# Altium project LimeSDR_1v2s.PrjPcb (part 3 of 4)

## Sheet 14_BoardPowerSupply.SchDoc: Board power supply
size A3; Organization: Lime Microsystems; Address1: Surrey Tech Centre; Address2: Guildford GU2 7YG; Address3: Surrey; Address4: United Kingdom; Revision: v1.2; SheetNumber: 14; SheetTotal: 14
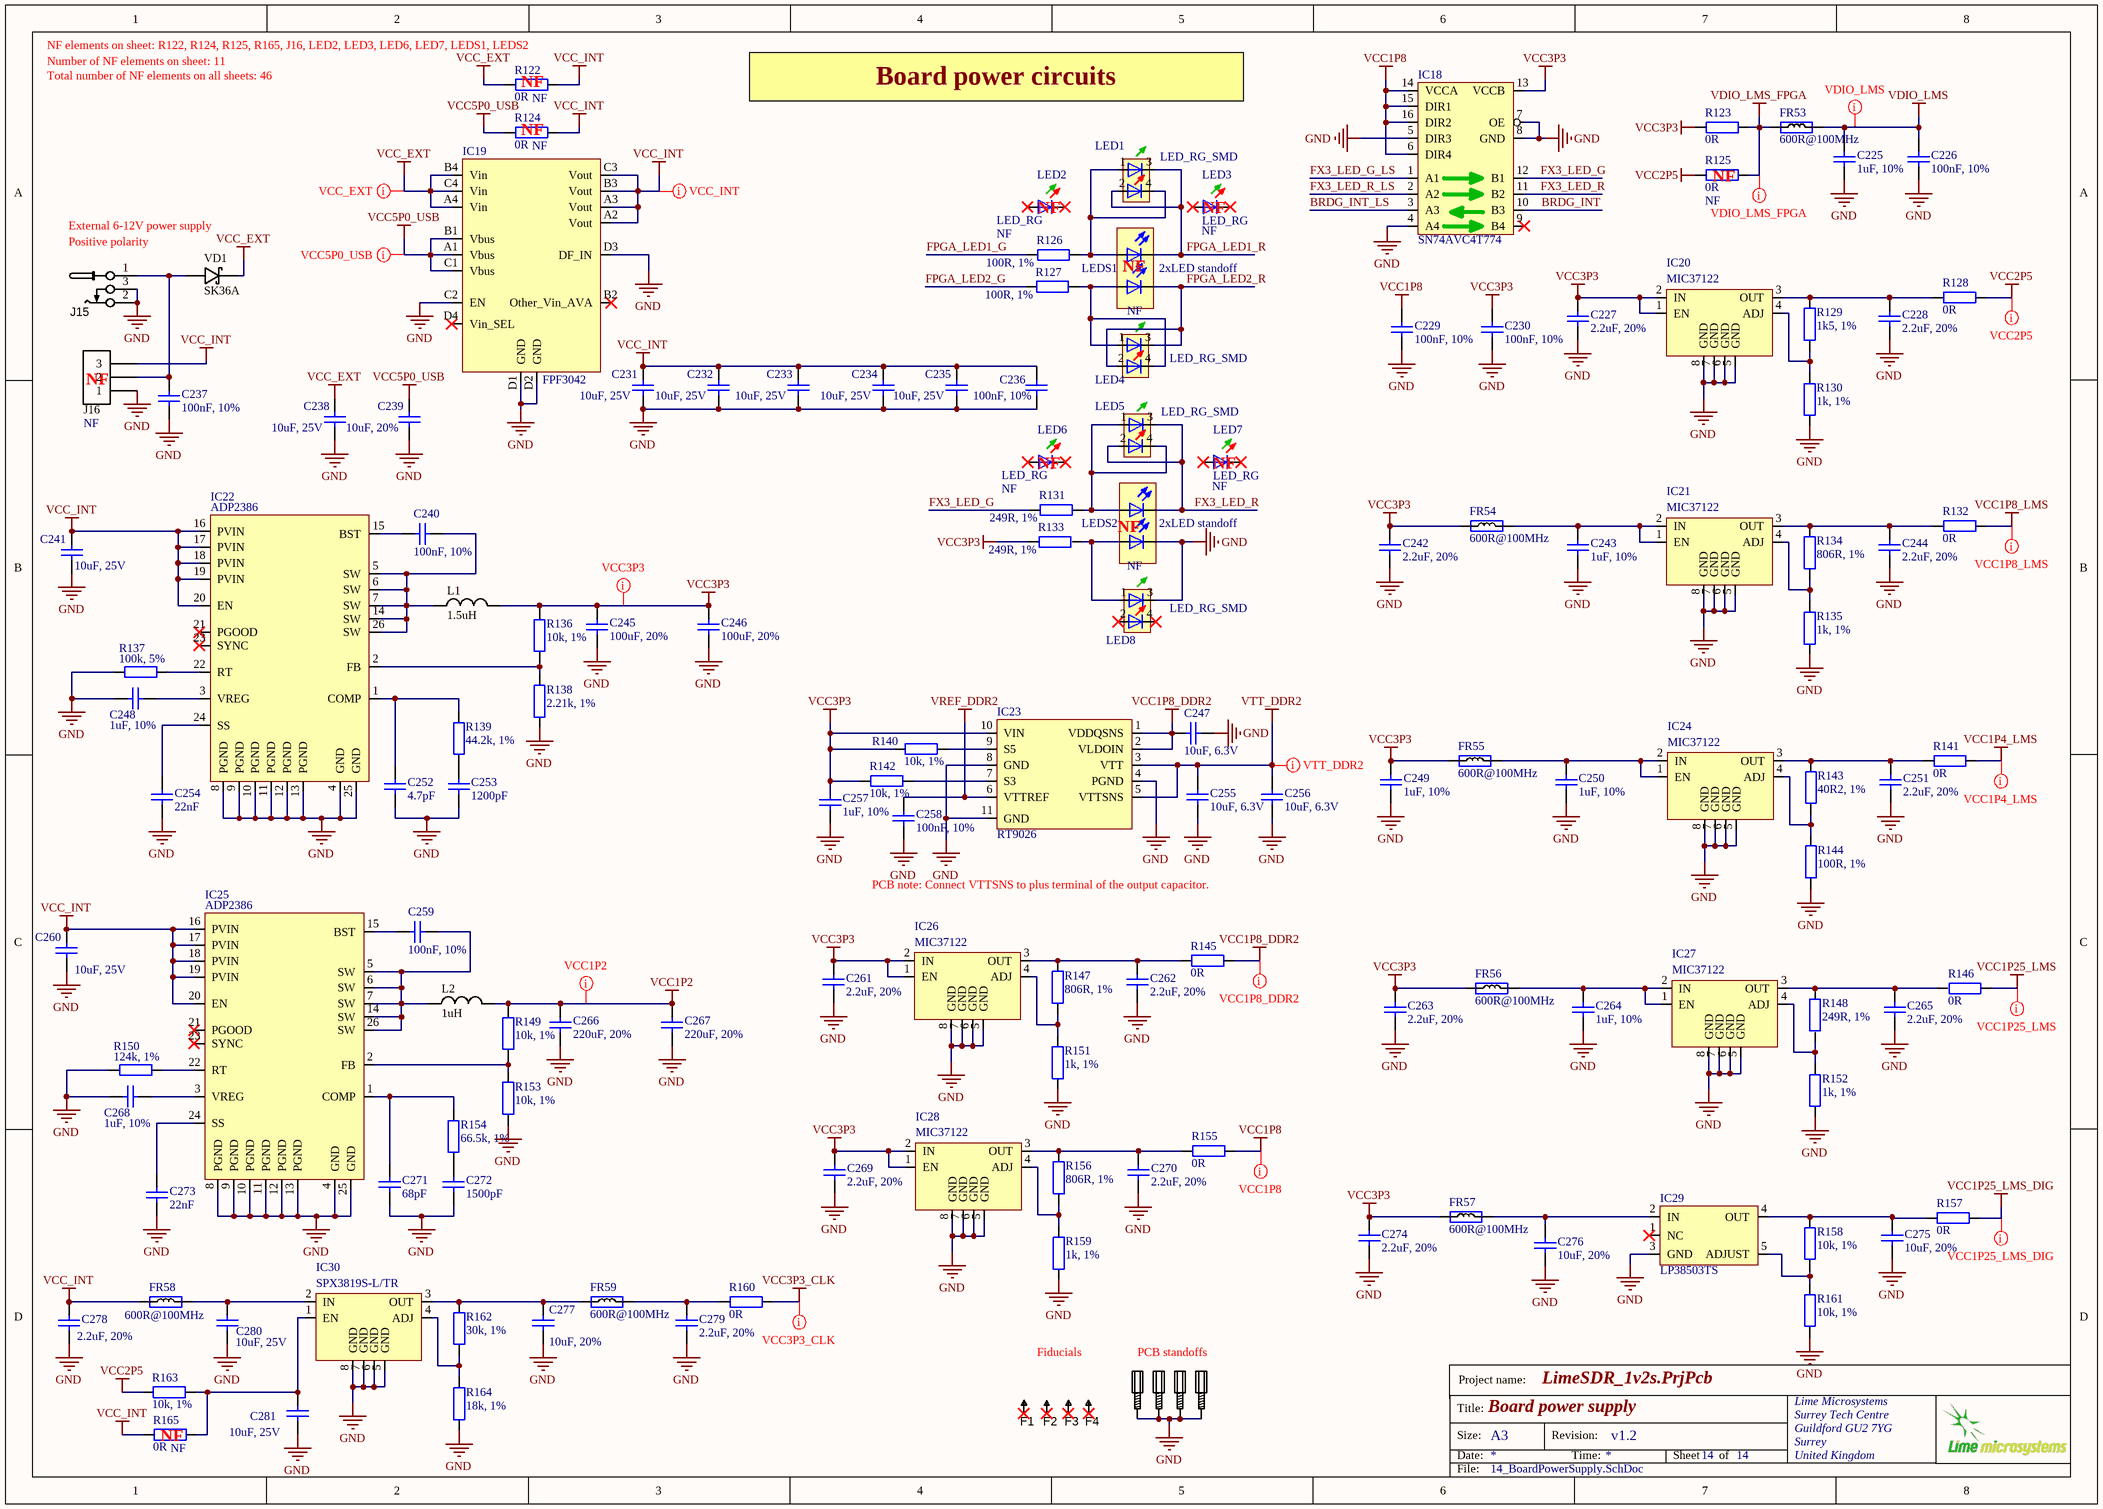
[diagram p9: 14_BoardPowerSupply.SchDoc]

### Parts
C225  1uF, 10%  [CAP0402]
C226  100nF, 10%  [CAP0402]
C227  2.2uF, 20%  [CAP0402]
C228  2.2uF, 20%  [CAP0402]
C229  100nF, 10%  [CAP0402]
C230  100nF, 10%  [CAP0402]
C231  10uF, 25V  [CAP0603]
C232  10uF, 25V  [CAP0603]
C233  10uF, 25V  [CAP0603]
C234  10uF, 25V  [CAP0603]
C235  10uF, 25V  [CAP0603]
C236  100nF, 10%  [CAP0402]
C237  100nF, 10%  [CAP0402]
C238  10uF, 25V  [CAP0603]
C239  10uF, 20%  [CAP0603]
C240  100nF, 10%  [CAP0402]
C241  10uF, 25V  [CAP0603]
C242  2.2uF, 20%  [CAP0402]
C243  1uF, 10%  [CAP0402]
C244  2.2uF, 20%  [CAP0402]
C245  100uF, 20%  [CAP1206]
C246  100uF, 20%  [CAP1206]
C247  10uF, 6.3V  [CAP0603]
C248  1uF, 10%  [CAP0402]
C249  1uF, 10%  [CAP0402]
C250  1uF, 10%  [CAP0402]
C251  2.2uF, 20%  [CAP0402]
C252  4.7pF  [CAP0402]
C253  1200pF  [CAP0402]
C254  22nF  [CAP0402]
C255  10uF, 6.3V  [CAP0603]
C256  10uF, 6.3V  [CAP0603]
C257  1uF, 10%  [CAP0402]
C258  100nF, 10%  [CAP0402]
C259  100nF, 10%  [CAP0402]
C260  10uF, 25V  [CAP0603]
C261  2.2uF, 20%  [CAP0402]
C262  2.2uF, 20%  [CAP0402]
C263  2.2uF, 20%  [CAP0402]
C264  1uF, 10%  [CAP0402]
C265  2.2uF, 20%  [CAP0402]
C266  220uF, 20%  [CAP1206]
C267  220uF, 20%  [CAP1206]
C268  1uF, 10%  [CAP0402]
C269  2.2uF, 20%  [CAP0402]
C270  2.2uF, 20%  [CAP0402]
C271  68pF  [CAP0402]
C272  1500pF  [CAP0402]
C273  22nF  [CAP0402]
C274  2.2uF, 20%  [CAP0402]
C275  10uF, 20%  [CAP0603]
C276  10uF, 20%  [CAP0603]
C277  10uF, 20%  [CAP0603]
C278  2.2uF, 20%  [CAP0402]
C279  2.2uF, 20%  [CAP0402]
C280  10uF, 25V  [CAP0603]
C281  10uF, 25V  [CAP0603]
F1  Fiducial  [Fiducial]  (value not drawn)
F2  Fiducial  [Fiducial]  (value not drawn)
F3  Fiducial  [Fiducial]  (value not drawn)
F4  Fiducial  [Fiducial]  (value not drawn)
FR53  600R@100MHz  [RES0805]
FR54  600R@100MHz  [RES0805]
FR55  600R@100MHz  [RES0805]
FR56  600R@100MHz  [RES0805]
FR57  600R@100MHz  [RES0805]
FR58  600R@100MHz  [RES0805]
FR59  600R@100MHz  [RES0805]
IC18  SN74AVC4T774  [SN74AVC4T774]
IC19  FPF3042  [FPF3042]
IC20  MIC37122  [MIC37122YM TR_SO8]
IC21  MIC37122  [MIC37122YM TR_SO8]
IC22  ADP2386  [ADP2386]
IC23  RT9026  [MSOP10]
IC24  MIC37122  [MIC37122YM TR_SO8]
IC25  ADP2386  [ADP2386]
IC26  MIC37122  [MIC37122YM TR_SO8]
IC27  MIC37122  [MIC37122YM TR_SO8]
IC28  MIC37122  [MIC37122YM TR_SO8]
IC29  LP38503TS  [TO-263-5_v2]
IC30  SPX3819S-L/TR  [MIC37122YM TR_SO8]
J15  CONN_PWR_JACK_2.1x5.5mm  [CONN_PWR_JACK_v3]  (value not drawn)
J16  Assembly Info: NF  [HDR_1x3]  (hidden comment: Header 3x1 pin)
L1  1.5uH  [FDVE1040_TOKO_INDUCTOR]
L2  1uH  [FDVE1040_TOKO_INDUCTOR]
LED1  LED_RG_SMD  [LED-2x0603]
LED2  LED_RG  Assembly Info: NF  (mechanical)
LED3  LED_RG  Assembly Info: NF  (mechanical)
LED4  LED_RG_SMD  [LED-2x0603]
LED5  LED_RG_SMD  [LED-2x0603]
LED6  LED_RG  Assembly Info: NF  (mechanical)
LED7  LED_RG  Assembly Info: NF  (mechanical)
LED8  LED_RG_SMD  [LED-2x0603]
LEDS1  2xLED standoff  Assembly Info: NF  [LED_STANDOFF_H-201C]
LEDS2  2xLED standoff  Assembly Info: NF  [LED_STANDOFF_H-201C]
MECH1  # pcs.  [PCB_standoff]  (value not drawn)
MECH2  # pcs.  [PCB_standoff]  (value not drawn)
MECH3  # pcs.  [PCB_standoff]  (value not drawn)
MECH4  # pcs.  [PCB_standoff]  (value not drawn)
R122  0R  Assembly Info: NF  [RES0402]
R123  0R  [RES0402]
R124  0R  Assembly Info: NF  [RES0402]
R125  0R  Assembly Info: NF  [RES0402]
R126  100R, 1%  [RES0402]
R127  100R, 1%  [RES0402]
R128  0R  [RES0402]
R129  1k5, 1%  [RES0402]
R130  1k, 1%  [RES0402]
R131  249R, 1%  [RES0402]
R132  0R  [RES0402]
R133  249R, 1%  [RES0402]
R134  806R, 1%  [RES0402]
R135  1k, 1%  [RES0402]
R136  10k, 1%  [RES0402]
R137  100k, 5%  [RES0402]
R138  2.21k, 1%  [RES0402]
R139  44.2k, 1%  [RES0402]
R140  10k, 1%  [RES0402]
R141  0R  [RES0402]
R142  10k, 1%  [RES0402]
R143  40R2, 1%  [RES0402]
R144  100R, 1%  [RES0402]
R145  0R  [RES0402]
R146  0R  [RES0402]
R147  806R, 1%  [RES0402]
R148  249R, 1%  [RES0402]
R149  10k, 1%  [RES0402]
R150  124k, 1%  [RES0402]
R151  1k, 1%  [RES0402]
R152  1k, 1%  [RES0402]
R153  10k, 1%  [RES0402]
R154  66.5k, 1%  [RES0402]
R155  0R  [RES0402]
R156  806R, 1%  [RES0402]
R157  0R  [RES0402]
R158  10k, 1%  [RES0402]
R159  1k, 1%  [RES0402]
R160  0R  [RES0402]
R161  10k, 1%  [RES0402]
R162  30k, 1%  [RES0402]
R163  10k, 1%  [RES0402]
R164  18k, 1%  [RES0402]
R165  0R  Assembly Info: NF  [RES0402]
VD1  SK36A  [DIODE_SMB]

### Nets
GND: C225.1 C226.2 C227.1 C228.1 C229.1 C230.1 C231.1 C232.1 C233.1 C234.1 C235.1 C236.2 C237.2 C238.1 C239.1 C241.1 C242.1 C243.1 C244.1 C245.1 C246.1 C247.1 C248.2 C249.1 C250.1 C251.1 C252.2 C253.2 C254.2 C255.1 C256.1 C257.1 C258.2 C260.1 C261.1 C262.1 C263.1 C264.1 C265.1 C266.1 C267.1 C268.2 C269.1 C270.1 C271.2 C272.2 C273.2 C274.1 C275.1 C276.1 C277.1 C278.1 C279.1 C280.1 C281.1 IC18.4(A4) IC18.5(DIR3) IC18.7(OE) IC18.8(GND) IC19.C2(EN) IC19.D1(GND) IC19.D2(GND) IC19.D3(DF_IN) IC20.5(GND) IC20.6(GND) IC20.7(GND) IC20.8(GND) IC21.5(GND) IC21.6(GND) IC21.7(GND) IC21.8(GND) IC22.4(GND) IC22.8(PGND) IC22.9(PGND) IC22.10(PGND) IC22.11(PGND) IC22.12(PGND) IC22.13(PGND) IC22.25(GND) IC23.4(PGND) IC23.8(GND) IC23.11(GND) IC24.5(GND) IC24.6(GND) IC24.7(GND) IC24.8(GND) IC25.4(GND) IC25.8(PGND) IC25.9(PGND) IC25.10(PGND) IC25.11(PGND) IC25.12(PGND) IC25.13(PGND) IC25.25(GND) IC26.5(GND) IC26.6(GND) IC26.7(GND) IC26.8(GND) IC27.5(GND) IC27.6(GND) IC27.7(GND) IC27.8(GND) IC28.5(GND) IC28.6(GND) IC28.7(GND) IC28.8(GND) IC29.3(GND) IC30.5(GND) IC30.6(GND) IC30.7(GND) IC30.8(GND) J15.2 J15.3 J16.1 LED8.3 LEDS2.K2(C) MECH1.MH1 MECH2.MH1 MECH3.MH1 MECH4.MH1 R130.1 R135.1 R137.2 R138.1 R144.2 R150.2 R151.1 R152.1 R153.2 R159.1 R161.2 R164.1
VCC1P2: C266.2 C267.2 L2.2 R149.1
VCC1P4_LMS: R141.1
VCC1P8: C229.2 IC18.6(DIR4) IC18.14(VCCA) IC18.15(DIR1) IC18.16(DIR2) R155.1
VCC1P8_DDR2: C247.2 IC23.1(VDDQSNS) IC23.2(VLDOIN) R145.1
VCC1P8_LMS: R132.1
VCC1P25_LMS: R146.1
VCC1P25_LMS_DIG: R157.1
VCC2P5: R125.2 R128.1 R163.1
VCC3P3: C227.2 C230.2 C242.2 C245.2 C246.2 C249.2 C257.2 C261.2 C263.2 C269.2 C274.2 FR54.1 FR55.1 FR56.1 FR57.1 IC18.13(VCCB) IC20.1(EN) IC20.2(IN) IC23.10(VIN) IC26.1(EN) IC26.2(IN) IC28.1(EN) IC28.2(IN) L1.2 R123.2 R133.1 R136.1 R140.1 R142.1
VCC3P3_CLK: R160.1
VCC5P0_USB: C239.2 IC19.A1(Vbus) IC19.B1(Vbus) IC19.C1(Vbus) R124.2
VCC_EXT: C238.2 IC19.A4(Vin) IC19.B4(Vin) IC19.C4(Vin) R122.2 VD1.K
VCC_INT: C231.2 C232.2 C233.2 C234.2 C235.2 C236.1 C241.2 C260.2 C278.2 FR58.1 IC19.A2(Vout) IC19.A3(Vout) IC19.B3(Vout) IC19.C3(Vout) IC22.16(PVIN) IC22.17(PVIN) IC22.18(PVIN) IC22.19(PVIN) IC22.20(EN) IC25.16(PVIN) IC25.17(PVIN) IC25.18(PVIN) IC25.19(PVIN) IC25.20(EN) J16.3 R122.1 R124.1 R165.2
VDIO_LMS: C225.2 C226.1 FR53.2
VDIO_LMS_FPGA: FR53.1 R123.1 R125.1
VREF_DDR2: C258.1 IC23.6(VTTREF)
VTT_DDR2: C255.2 C256.2 IC23.3(VTT) IC23.5(VTTSNS)
BRDG_INT: IC18.10(B3)
BRDG_INT_LS: IC18.3(A3)
FPGA_LED1_G: R126.1
FPGA_LED1_R: LED1.2 LED1.3 LEDS1.K1(C)
FPGA_LED2_G: R127.1
FPGA_LED2_R: LED4.2 LED4.3 LEDS1.K2(C)
FX3_LED_G: IC18.12(B1) R131.1
FX3_LED_G_LS: IC18.1(A1)
FX3_LED_R: IC18.11(B2) LED5.2 LED5.3 LEDS2.K1(C)
FX3_LED_R_LS: IC18.2(A2)
NetC228_2: C228.2 IC20.3(OUT) R128.2 R129.1
NetC237_1: C237.1 J15.1 J16.2 VD1.A
NetC240_1: C240.1 IC22.15(BST)
NetC240_2: C240.2 IC22.5(SW) IC22.6(SW) IC22.7(SW) IC22.14(SW) IC22.26(SW) L1.1
NetC243_2: C243.2 FR54.2 IC21.1(EN) IC21.2(IN)
NetC244_2: C244.2 IC21.3(OUT) R132.2 R134.1
NetC248_1: C248.1 IC22.3(VREG)
NetC250_2: C250.2 FR55.2 IC24.1(EN) IC24.2(IN)
NetC251_2: C251.2 IC24.3(OUT) R141.2 R143.1
NetC252_1: C252.1 IC22.1(COMP) R139.2
NetC253_1: C253.1 R139.1
NetC254_1: C254.1 IC22.24(SS)
NetC259_1: C259.1 IC25.15(BST)
NetC259_2: C259.2 IC25.5(SW) IC25.6(SW) IC25.7(SW) IC25.14(SW) IC25.26(SW) L2.1
NetC262_2: C262.2 IC26.3(OUT) R145.2 R147.1
NetC264_2: C264.2 FR56.2 IC27.1(EN) IC27.2(IN)
NetC265_2: C265.2 IC27.3(OUT) R146.2 R148.1
NetC268_1: C268.1 IC25.3(VREG)
NetC270_2: C270.2 IC28.3(OUT) R155.2 R156.1
NetC271_1: C271.1 IC25.1(COMP) R154.2
NetC272_1: C272.1 R154.1
NetC273_1: C273.1 IC25.24(SS)
NetC275_2: C275.2 IC29.4(OUT) R157.2 R158.1
NetC276_2: C276.2 FR57.2 IC29.2(IN)
NetC277_2: C277.2 FR59.1 IC30.3(OUT) R162.1
NetC279_2: C279.2 FR59.2 R160.2
NetC280_2: C280.2 FR58.2 IC30.2(IN)
NetC281_2: C281.2 IC30.1(EN) R163.2 R165.1
NetIC20_4: IC20.4(ADJ) R129.2 R130.2
NetIC21_4: IC21.4(ADJ) R134.2 R135.2
NetIC22_2: IC22.2(FB) R136.2 R138.2
NetIC22_22: IC22.22(RT) R137.1
NetIC23_7: IC23.7(S3) R142.2
NetIC23_9: IC23.9(S5) R140.2
NetIC24_4: IC24.4(ADJ) R143.2 R144.1
NetIC25_2: IC25.2(FB) R149.2 R153.1
NetIC25_22: IC25.22(RT) R150.1
NetIC26_4: IC26.4(ADJ) R147.2 R151.2
NetIC27_4: IC27.4(ADJ) R148.2 R152.2
NetIC28_4: IC28.4(ADJ) R156.2 R159.2
NetIC29_5: IC29.5(ADJUST) R158.2 R161.1
NetIC30_4: IC30.4(ADJ) R162.2 R164.2
NetLED1_1: LED1.1 LED1.4 LEDS1.A1(A) R126.2
NetLED4_1: LED4.1 LED4.4 LEDS1.A2(A) R127.2
NetLED5_1: LED5.1 LED5.4 LEDS2.A1(A) R131.2
NetLED8_1: LED8.1 LEDS2.A2(A) R133.2

Not connected (* = marked no-connect by the designer): F1 1*; F2 1*; F3 1*; F4 1*; IC18 9(B4)*; IC19 B2(Other_Vin_AVA)* D4(Vin_SEL)*; IC22 21(PGOOD)* 23(SYNC)*; IC25 21(PGOOD)* 23(SYNC)*; IC29 1(NC)*; LED2 A* K(C)*; LED3 A* K(C)*; LED6 A* K(C)*; LED7 A* K(C)*; LED8 2* 4*

### Layout directives
net class VDIO_LMS: VDIO_LMS
net class VDIO_LMS_FPGA: VDIO_LMS_FPGA
net class VCC2P5: VCC2P5
net class VCC1P8_LMS: VCC1P8_LMS
net class VCC1P4_LMS: VCC1P4_LMS
net class VCC1P25_LMS: VCC1P25_LMS
net class VCC1P25_LMS_DIG: VCC1P25_LMS_DIG
net class VCC1P8_DDR2: VCC1P8_DDR2
net class VCC1P8: VCC1P8
net class VCC3P3_CLK: VCC3P3_CLK
net class VCC1P2: VCC1P2
net class VCC3P3: VCC3P3
net class VCC_INT: VCC_INT
net class VCC_EXT: VCC_EXT
net class VCC5P0_USB: VCC5P0_USB
net class VTT_DDR2: VTT_DDR2

### Notes on the sheet
- Number of NF elements on sheet: 11
- Total number of NF elements on all sheets: 46
- (near R122) NF elements on sheet: R122, R124, R125, R165, J16, LED2, LED3, LED6, LED7, LEDS1, LEDS2
- (near R122) NF
- Board power circuits
- (near R124) NF
- (near R125) NF
- Positive polarity
- External 6-12V power supply
- (near LED2) NF
- (near LED3) NF
- (near LEDS1) NF
- (near J16) NF
- (near LED6) NF
- (near LED7) NF
- (near LEDS2) NF
- PCB note: Connect VTTSNS to plus terminal of the output capacitor.
- Fiducials
- PCB standoffs
- (near R165) NF
- Project name:
- Title:
- Size:
- Date:
- A3
- Revision:
- Time:
- Sheet
- of
- File:

### Library data of the parts
C225 C243 C248-C250 C257 C264 C268 = Cap_0402: Manufacturer Part Number 1: GRM155R61A105KE15J; Manufacturer: TDK; Part Description: 1µF ±10% 10V X5R Ceramic Capacitor -55°C ~ 85°C Surface Mount, MLCC 0402 (1005 Metric) 0.039" L x 0.020" W (1.00mm x 0.50mm); Voltage Rating: 10; Product Range: TDK - C Series; Ceramic Capacitor Case: 0402 [1005 Metric]; Capacitance: 1; Dielectric Characteristic: X6; Value: 1uF, 10%; Supplier 1: Newark; Supplier Part Number 1: 490-6298-2-ND; Capacitance Tolerance: ± 10%; MSL: -; RoHS: YES
C226 C229 C230 C236 C237 C258 = Cap_0402: Manufacturer: Murata Electronics; Manufacturer Part Number: GRM155R71C104KA88D; Part Description: 0.10µF ±10% 16V X7R Ceramic Capacitor -55°C ~ 125°C Surface Mount, MLCC 0402 (1005 Metric) 0.039" L x 0.020" W (1.00mm x 0.50mm); Voltage Rating DC: 16 V; Type: General Purpose MLCC; Capacitance: 0.1 uF; Case Length: 1 mm; Dielectric: X7R; Case Height: 0.5 mm; Temperature Coefficient / Code: +/- 15 %; Value: 100nF, 10%; Supplier 1: Mouser; Supplier Part Number 1: 81-GRM155R71C104KA88; Case Code - in: 0402; RoHS: RoHS Compliant; Operating Temperature Range: - 55 C to + 125 C; Series: GRM; Termination Style: SMD/SMT; Tolerance: 10 %; Package / Case: 0402 (1005 metric); Maximum Operating Temperature: + 125 C; Case Code - mm: 1005; Minimum Operating Temperature: - 55 C; Product Category: Low & Medium Capacitance SMD Ceramic Chip Capacitors; Packaging: Reel; Product: General Type MLCCs; Category: Multilayer Ceramic Capacitors MLCC - SMD/SMT; Brand: Murata Electronics; Case Width: 0.5 mm; RoHS - Mouser: Y; Standard Pack Qty: 10000; Minimum Order Quantity: 1; Reeling: True; Manufacturer Part Number 1: GRM155R71C104KA88D
C227 C228 C242 C244 C251 C261-C263 C265 C269 C270 C274 C278 C279 = Cap_0402: Manufacturer Part Number 1: C1005X5R1C225K050BC; Manufacturer: TDK Corporation; Part Description: 2.2µF ±10% 16V X5R Ceramic Capacitor -55°C ~ 85°C Surface Mount, MLCC 0402 (1005 Metric) 0.039" L x 0.020" W (1.00mm x 0.50mm); Voltage - Rated: 16V; Temperature Coefficient: X5R; Capacitance: 2.2µF; Value: 2.2uF, 20%; Supplier 1: Digi-Key; Supplier Part Number 1: 445-9085-1-ND; Category: Capacitors; Thickness (Max): 0.022" (0.55mm); Applications: General Purpose; Package / Case: 0402 (1005 Metric); Size / Dimension: 0.039" L x 0.020" W (1.00mm x 0.50mm); Features: -; Mounting Type: Surface Mount, MLCC; Ratings: -; Lead Style: -; Operating Temperature: -55°C ~ 85°C; Lead Spacing: -; RoHS: RoHS Compliant; Height - Seated (Max): -; Tolerance: ±20%; Packaging: Tape & Reel (TR)
C231-C235 C238 C241 C260 C280 C281 = Cap_0603: Manufacturer: Murata Electronics North America; Manufacturer Part Number: GRM188R61E106MA73D; Part Description: 10µF ±20% 25V X5R Ceramic Capacitor -55°C ~ 85°C Surface Mount, MLCC 0603 (1608 Metric) 0.063" L x 0.031" W (1.60mm x 0.80mm); Capacitance: 10µF; Tolerance: ±20%; Temperature Coefficient: X5R; Supplier 1: Digi-Key; Supplier Part Number 1: 490-7202-2-ND; Category: Capacitors; RoHS: RoHS Compliant; Packaging: Tape & Reel (TR); Voltage - Rated: 25V; Mounting Type: Surface Mount, MLCC; Operating Temperature: -55°C ~ 85°C; Applications: General Purpose; Ratings: -; Package / Case: 0603 (1608 Metric); Size / Dimension: 0.063" L x 0.031" W (1.60mm x 0.80mm); Height - Seated (Max): -; Thickness (Max): 0.031" (0.80mm); Lead Spacing: -; Features: -; Lead Style: -; value: 10uF, 25V
C239 C275-C277 = Cap_0603: Manufacturer: Yageo; Manufacturer Part Number 1: GRM188R61C106MA73D; Part Description: 10µF ±20% 16V X5R Ceramic Capacitor -55°C ~ 85°C Surface Mount, MLCC 0603 (1608 Metric) 0.063" L x 0.031" W (1.60mm x 0.80mm); Temperature Coefficient: X5R; Capacitance: 10µF; Voltage - Rated: 16V; Value: 10uF, 20%; Supplier 1: Digi-Key; Supplier Part Number 1: 490-7201-2-ND; Category: Capacitors; Ratings: -; Features: -; Lead Style: -; Package / Case: 0603 (1608 Metric); Lead Spacing: -; Applications: General Purpose; Operating Temperature: -55°C ~ 85°C; Tolerance: ±20%; Thickness (Max): 0.039" (1.00mm); Mounting Type: Surface Mount, MLCC; RoHS: RoHS Compliant; Size / Dimension: 0.063" L x 0.031" W (1.60mm x 0.80mm); Packaging: Tape & Reel (TR); Height - Seated (Max): -
C240 C259 = Cap_0402: Manufacturer: Murata Electronics; Manufacturer Part Number 1: GRM155R71C104KA88D; Part Description: 0.10µF ±10% 16V X7R Ceramic Capacitor -55°C ~ 125°C Surface Mount, MLCC 0402 (1005 Metric) 0.039" L x 0.020" W (1.00mm x 0.50mm); Voltage Rating DC: 16 V; Type: General Purpose MLCC; Capacitance: 0.1 uF; Case Length: 1 mm; Dielectric: X7R; Case Height: 0.5 mm; Temperature Coefficient / Code: +/- 15 %; Value: 100nF, 10%; Supplier 1: Mouser; Supplier Part Number 1: 81-GRM155R71C104KA88; Case Code - in: 0402; RoHS: RoHS Compliant; Operating Temperature Range: - 55 C to + 125 C; Series: GRM; Termination Style: SMD/SMT; Tolerance: 10 %; Package / Case: 0402 (1005 metric); Maximum Operating Temperature: + 125 C; Case Code - mm: 1005; Minimum Operating Temperature: - 55 C; Product Category: Low & Medium Capacitance SMD Ceramic Chip Capacitors; Packaging: Reel; Product: General Type MLCCs; Category: Multilayer Ceramic Capacitors MLCC - SMD/SMT; Brand: Murata Electronics; Case Width: 0.5 mm; RoHS - Mouser: Y; Standard Pack Qty: 10000; Minimum Order Quantity: 1; Reeling: True; Manufacturer Part Number: GRM155R71C104KA88D
C245 C246 = Cap_1206: Manufacturer Part Number 1: GRM31CR60J107ME39L.; Part Description: 100µF ±20% 6.3V X5R Ceramic Capacitor -55°C ~ 85°C Surface Mount, MLCC 1206 (3216 Metric) 0.126" L x 0.063" W (3.20mm x 1.60mm); Manufacturer: Murata Electronics North America; Ceramic Capacitor Case: 1206 [3216 Metric]; Voltage Rating: 6.3; Capacitance Tolerance: ± 20%; value: 100uF, 20%; Supplier Part Number 1: 1735535; Supplier 1: Farnell
C247 C255 C256 = Cap_0603: Manufacturer Part Number 1: CC0603MRX5R5BB106; Part Description: 10µF ±20% 6.3V X5R Ceramic Capacitor -55°C ~ 85°C Surface Mount, MLCC 0603 (1608 Metric) 0.063" L x 0.031" W (1.60mm x 0.80mm); Manufacturer: Yageo; Capacitance: 10µF; Tolerance: ±20%; Supplier 1: Digi-Key; Supplier Part Number 1: 311-1448-2-ND; Package / Case: 0603 (1608 Metric); Category: Capacitors; Voltage - Rated: 6.3V; Value: 10uF, 6.3V
C252 = Cap_0402: Manufacturer Part Number 1: GRM1555C1H4R7CA01D; Part Description: 4.7pF ±0.25pF 50V C0G, NP0 Ceramic Capacitor -55°C ~ 125°C Surface Mount, MLCC 0402 (1005 Metric) 0.039" L x 0.020" W (1.00mm x 0.50mm); Manufacturer: Murata Electronics North America; Capacitance Tolerance: ± 0.25; Voltage Rating: 50; Dielectric Characteristic: C0G / NP0; Ceramic Capacitor Case: 0402 [1005 Metric]; Capacitance: 4.7; SVHC: No SVHC (15-Jun-2015; Product Range: GRM Series; Value: 4.7pF; Supplier 1: Farnell; Supplier Part Number 1: 2434644; Operating Temperature Max: 125; Operating Temperature Min: -55; MSL: MSL 1 - Unlimited; RoHS: YES; Packaging: Cut Tape
C253 = Cap_0402: Manufacturer: Kemet; Manufacturer Part Number 1: C0402C122J5GACTU; Part Description: 1200pF ±5% 50V C0G, NP0 Ceramic Capacitor -55°C ~ 125°C Surface Mount, MLCC 0402 (1005 Metric) 0.039" L x 0.020" W (1.00mm x 0.50mm); Temperature Coefficient: C0G, NP0; Tolerance: ±5%; Voltage - Rated: 50V; Value: 1200pF; Supplier 1: Digi-Key; Supplier Part Number 1: 399-7334-1-ND; Thickness (Max): 0.022" (0.55mm); Capacitance: 1200pF; Lead Spacing: -; Mounting Type: Surface Mount, MLCC; Package / Case: 0402 (1005 Metric); Category: Capacitors; Size / Dimension: 0.039" L x 0.020" W (1.00mm x 0.50mm); Lead Style: -; Ratings: -; Features: -; Packaging: Cut Tape (CT); RoHS: RoHS Compliant; Operating Temperature: -55°C ~ 125°C; Applications: General Purpose; Height - Seated (Max): -
C254 C273 = Cap_0402: Manufacturer: Kemet; Manufacturer Part Number 1: C0402C223K5RACTU; Part Description: 0.022µF ±10% 50V X7R Ceramic Capacitor -55°C ~ 125°C Surface Mount, MLCC 0402 (1005 Metric) 0.039" L x 0.020" W (1.00mm x 0.50mm); Temperature Coefficient: X7R; Tolerance: ±10%; Voltage - Rated: 50V; Capacitance: 0.022µF; Value: 22nF; Supplier 1: Digi-Key; Supplier Part Number 1: 399-7780-1-ND; Ratings: -; Packaging: Cut Tape (CT); Category: Capacitors; Size / Dimension: 0.039" L x 0.020" W (1.00mm x 0.50mm); RoHS: RoHS Compliant; Operating Temperature: -55°C ~ 125°C; Mounting Type: Surface Mount, MLCC; Applications: General Purpose; Thickness (Max): 0.022" (0.55mm); Features: -; Height - Seated (Max): -; Lead Style: -; Package / Case: 0402 (1005 Metric); Lead Spacing: -
C266 C267 = Cap_1206: Manufacturer: Murata Electronics North America; Manufacturer Part Number 1: GRM31CR60G227ME11L; Part Description: 220µF ±20% 4V X5R Ceramic Capacitor -55°C ~ 85°C Surface Mount, MLCC 1206 (3216 Metric) 0.126" L x 0.063" W (3.20mm x 1.60mm); Voltage - Rated: 4V; Capacitance: 220µF; Temperature Coefficient: X5R; value: 220uF, 20%; Supplier 1: Digi-Key; Supplier Part Number 1: 490-9774-6-ND; Category: Capacitors; Height - Seated (Max): -; Lead Style: -; Packaging: Digi-Reel®; Package / Case: 1206 (3216 Metric); Mounting Type: Surface Mount, MLCC; Applications: General Purpose; Lead Spacing: -; Tolerance: ±20%; Ratings: -; RoHS: RoHS Compliant; Operating Temperature: -55°C ~ 85°C; Size / Dimension: 0.126" L x 0.063" W (3.20mm x 1.60mm); Thickness (Max): 0.075" (1.90mm); Features: -
C271 = Cap_0402: Manufacturer Part Number 1: CBR04C680F3GAC; Manufacturer: Kemet; Part Description: 68pF ±1% 25V C0G, NP0 Ceramic Capacitor -55°C ~ 125°C Surface Mount, MLCC 0402 (1005 Metric) 0.039" L x 0.020" W (1.00mm x 0.50mm); Temperature Coefficient: C0G, NP0; Voltage - Rated: 25V; Tolerance: ±1%; Value: 68pF; Supplier 1: Digi-Key; Supplier Part Number 1: 399-11255-1-ND; Applications: RF, Microwave, High Frequency; Capacitance: 68pF; Mounting Type: Surface Mount, MLCC; Package / Case: 0402 (1005 Metric); Features: High Q, Low Loss; Lead Spacing: -; Size / Dimension: 0.039" L x 0.020" W (1.00mm x 0.50mm); Operating Temperature: -55°C ~ 125°C; Packaging: Cut Tape (CT); Thickness (Max): 0.022" (0.55mm); Category: Capacitors; Lead Style: -; Ratings: -; Height - Seated (Max): -; RoHS: RoHS Compliant
C272 = Cap_0402: Manufacturer Part Number 1: CL05B152KB5NNNC; Manufacturer: Samsung Electro-Mechanics America, Inc.; Part Description: 1500pF ±10% 50V X7R Ceramic Capacitor -55°C ~ 125°C Surface Mount, MLCC 0402 (1005 Metric) 0.039" L x 0.020" W (1.00mm x 0.50mm); Temperature Coefficient: X7R; Voltage - Rated: 50V; Tolerance: ±10%; Value: 1500pF; Supplier 1: Digi-Key; Supplier Part Number 1: 1276-1521-1-ND; Thickness (Max): 0.022" (0.55mm); Features: -; Category: Capacitors; Size / Dimension: 0.039" L x 0.020" W (1.00mm x 0.50mm); RoHS: RoHS Compliant; Package / Case: 0402 (1005 Metric); Mounting Type: Surface Mount, MLCC; Packaging: Cut Tape (CT); Lead Style: -; Lead Spacing: -; Capacitance: 1500pF; Applications: General Purpose; Height - Seated (Max): -; Ratings: -; Operating Temperature: -55°C ~ 125°C
FR53-FR59 = Ferrite: Manufacturer Part Number 1: MPZ2012S601AT000; Manufacturer: TDK Corporation; Part Description: FERRITE BEAD 600 OHM 0805 1LN; Filter Type: Differential Mode - Single; Impedance @ Frequency: 600 Ohm @ 100MHz; DC Resistance (DCR): 100 mOhm Max; Current Rating: 2A; Supplier 1: Digi-Key; Supplier Part Number 1: 445-2206-2-ND; Mounting Type: Surface Mount; RoHS: RoHS Compliant; Height (Max): 0.041" (1.05mm); Packaging: Tape & Reel (TR); Category: Filters; Package / Case: 0805 (2012 Metric); Size / Dimension: 0.079" L x 0.049" W (2.00mm x 1.25mm)
IC18 = SN74AVC4T774: Manufacturer: Texas Instruments; Manufacturer Part Number 1: SN74AVC4T774RSVR; Part Description: IC BUS TRANSCVR 4BIT DUAL 16QFN; Logic Function: Translator, Bidirectional, 3-State; Differential - Input:Output: No/No; Propagation Delay (Max): 2.4ns; Number of Bits: 4; Number of Outputs/Channel: 1; Input Type: Logic; Voltage - Supply: 1.2 V ~ 3.6 V; Data Rate: 380Mbps; Supplier 1: Digi-Key; Supplier Device Package: 16-UQFN (2.6x1.8); Packaging: Digi-Reel®; Category: Integrated Circuits (ICs); Mounting Type: Surface Mount; RoHS: RoHS Compliant; Number of Channels: 4; Output Type: Logic; Package / Case: 16-UFQFN; Operating Temperature: -40°C ~ 85°C; Supplier Part Number 1: 296-24741-6-ND
IC19 = FPF3042: Manufacturer: Fairchild Semiconductor; Manufacturer Part Number 1: FPF3042UCX; Part Description: IC OR CTRLR SRC SELECT 16WLCSP; Current - Output (Max): 2.7A; Voltage - Supply: 4 V ~ 12.4 V; FET Type: N-Channel; Internal Switch(s): Yes; Current - Supply: 55µA; Ratio - Input:Output: 2:1; Supplier 1: Digi-Key; Operating Temperature: -40°C ~ 85°C; Type: Source Selector Switch; Delay Time - OFF: -; Package / Case: 16-UFBGA, WLCSP; Delay Time - ON: -; Mounting Type: Surface Mount; Applications: Handheld/Mobile Devices; Supplier Device Package: 16-WLCSP; Packaging: Cut Tape (CT); Category: Integrated Circuits (ICs); RoHS: RoHS Compliant; Supplier Part Number 1: FPF3042UCXCT-ND
IC20 IC21 IC24 IC26-IC28 = MIC37122: Manufacturer Part Number 1: MIC37122YM TR; Part Description: IC REG LDO ADJ 1A 8SOIC; Manufacturer: Microchip Technology; Voltage - Input: 2.375 V ~ 5.5 V; Supplier 1: Digi-Key; Supplier: Digi-Key; Package / Case: 8-SOIC (0.154", 3.90mm Width); Supplier Part Number 1: 576-4334-2-ND
IC22 = ADP2386: Manufacturer Part Number: ADP2386ACPZN-R7; Manufacturer: Analog Devices Inc.; Part Description: IC REG BUCK ADJ 6A SYNC 24LFCSP; Function: Step-Down; Voltage - Output (Max): 18V; Synchronous Rectifier: Yes; Output Configuration: Positive; Frequency - Switching: 200kHz ~ 1.4MHz; Number of Outputs: 1; Output Type: Adjustable; Topology: Buck; Voltage - Input (Min): 4.5V; Voltage - Output (Min/Fixed): 0.6V; Voltage - Input (Max): 20V; Current - Output: 6A; Supplier 1: Digi-Key; Packaging: Digi-Reel®; RoHS: RoHS Compliant; Package / Case: 24-WFQFN Exposed Pad, CSP; Operating Temperature: -40°C ~ 125°C (TJ); Supplier Device Package 1: 24-LFCSP-WQ (4x4); Mounting Type: Surface Mount; Category: Integrated Circuits (ICs); Supplier Part Number 1: ADP2386ACPZN-R7DKR-ND
IC23 = RT9026: Manufacturer Part Number 1: RT9026GFP; Manufacturer: Richtek USA Inc.; Part Description: IC DDR TERMINATION REG 10MSOP; Number of Outputs: 1; Voltage - Input: 3.15 V ~ 5.5 V; Supplier 1: Digi-Key; Supplier Part Number 1: 1028-1010-1-ND; Supplier Device Package: 10-MSOP-EP; Operating Temperature: -40°C ~ 85°C; Applications: Converter, DDR Bus Termination Regulator; RoHS: RoHS Compliant; Packaging: Cut Tape (CT); Mounting Type: Surface Mount; Package / Case: 10-TFSOP, 10-MSOP (0.118", 3.00mm Width) Exposed Pad; Category: Integrated Circuits (ICs)
IC25 = ADP2386: Manufacturer Part Number 1: ADP2386ACPZN-R7; Manufacturer: Analog Devices Inc.; Part Description: IC REG BUCK ADJ 6A SYNC 24LFCSP; Function: Step-Down; Voltage - Output (Max): 18V; Synchronous Rectifier: Yes; Output Configuration: Positive; Frequency - Switching: 200kHz ~ 1.4MHz; Number of Outputs: 1; Output Type: Adjustable; Topology: Buck; Voltage - Input (Min): 4.5V; Voltage - Output (Min/Fixed): 0.6V; Voltage - Input (Max): 20V; Current - Output: 6A; Supplier 1: Digi-Key; Packaging: Digi-Reel®; RoHS: RoHS Compliant; Package / Case: 24-WFQFN Exposed Pad, CSP; Operating Temperature: -40°C ~ 125°C (TJ); Supplier Device Package: 24-LFCSP-WQ (4x4); Mounting Type: Surface Mount; Category: Integrated Circuits (ICs); Supplier Part Number 1: ADP2386ACPZN-R7DKR-ND
IC29 = LP38503TS: Manufacturer Part Number: LP38503TS-ADJ/NOPB; Manufacturer: Texas Instruments; Part Description: IC REG LDO ADJ 3A TO263-5; Regulator Topology: Positive Adjustable; Voltage - Dropout (Typical): 0.42V @ 3A; Number of Regulators: 1; Current - Output: 3A; Voltage - Output: 0.6 V ~ 5 V; Voltage - Input: 2.7 V ~ 5.5 V; Supplier 1: Digi-Key; Category: Integrated Circuits (ICs); RoHS: RoHS Compliant By Exemption; Operating Temperature: -40°C ~ 125°C; Packaging: Tube; Current - Limit (Min): -; Package / Case: TO-263-6, D²Pak (5 Leads + Tab), TO-263BA; Mounting Type: Surface Mount; Supplier Device Package: DDPAK/TO-263-5; Supplier Part Number 1: LP38503TS-ADJ/NOPB-ND
IC30 = MIC37122: Manufacturer: Exar Corporation; Part Description: IC REG LDO ADJ 0.5A 8SOIC; Voltage - Output: Adjustable; Regulator Topology: Positive Adjustable; Number of Regulators: 1; Voltage - Dropout (Typical): 0.34V @ 500mA; Voltage - Input: 2.5 V ~ 16 V; Current - Output: 500mA; Category: Integrated Circuits (ICs); Supplier 1: Digi-Key; Supplier Part Number 1: 1016-1854-1-ND; Current - Limit (Min): -; Operating Temperature: -40°C ~ 125°C; Package / Case: 8-SOIC (0.154", 3.90mm Width); Mounting Type: Surface Mount; RoHS: RoHS Compliant; Packaging: Cut Tape (CT); Supplier Device Package: 8-SOIC N; Manufacturer Part Number: SPX3819S-L/TR
J15 = CONN_PWR_JACK_2.1x5.5mm: Power Connector, THT, 2.1mm ID, 5.5mm OD; Manufacturer Part Number 1: PJ-031DH; Manufacturer: CUI Inc.; Part Description: CON PWR JCK 1.3 X 4.2MM HIGH CUR; Internal Switch(s): Single Switch, Normally Closed; Current Rating: 3.5A; Connector Type: Jack; Gender: Male; Shielding: Unshielded; Voltage - Rated: 16VDC; Plug/Mating Plug Diameter: 1.35mm ID, 3.5mm OD; Number of Positions/Contacts: 2 Conductors, 3 Contacts; Supplier 1: Digi-Key; Supplier Part Number 1: CP-031DH-ND; Operating Temperature: -25°C ~ 85°C; Contact Material: Brass; RoHS: RoHS Compliant; Color: Black; Features: -; Housing Material: Thermoplastic; Housing Color: Black; Contact Material - Plating: Nickel; Mounting Type: Through Hole, Right Angle; Termination: Solder; Category: Connectors, Interconnects
J16 = Header3P: Header, 3-pin; Manufacturer Part Number 1: 68000-103HLF; Manufacturer: Amphenol FCI; Part Description: 3 Positions Header, Unshrouded Connector 0.100" (2.54mm) Through Hole Gold or Gold, GXT; Connector Type: Header, Unshrouded; Pitch: 0.100" (2.54mm); Number of Positions Loaded: All; Number of Positions: 3; Supplier 1: Digi-Key; Supplier Part Number 1: 609-3461-ND; Features: -; Fastening Type: -; Contact Finish: Gold or Gold, GXT™; Contact Mating Length: 0.230" (5.84mm); Contact Type: Male Pin; RoHS: RoHS Compliant; Color: Black; Termination: Solder; Row Spacing: -; Category: Connectors, Interconnects; Mounting Type: Through Hole; Contact Finish Thickness: 30µin (0.76µm); Number of Rows: 1; Packaging: Bulk
L1 = Inductor_0603: Manufacturer: Vishay Dale; Manufacturer Part Number 1: IHLP4040DZER1R5M01; Part Description: FIXED IND 1.5UH 15A 5.8 MOHM SMD; DC Resistance (DCR): 5.8 mOhm Max; Inductance: 1.5µH; Shielding: Shielded; Type: Molded; Current Rating: 15A; Frequency - Test: 100kHz; Current - Saturation: 27.5A; Tolerance: ±20%; Value: 1.5uH; Supplier 1: Digi-Key; Supplier Part Number 1: 541-1301-6-ND; Package / Case: Nonstandard; Q @ Freq: -; Packaging: Digi-Reel®; Material - Core: -; Category: Inductors, Coils, Chokes; Frequency - Self Resonant: -; Height - Seated (Max): 0.158" (4.00mm); Supplier Device Package: -; RoHS: RoHS Compliant; Size / Dimension: 0.430" L x 0.405" W (10.92mm x 10.30mm); Mounting Type: Surface Mount; Operating Temperature: -55°C ~ 125°C
L2 = Inductor_0603: Manufacturer: Vishay Dale; Manufacturer Part Number 1: IHLP3232DZER1R0M01; Part Description: FIXED IND 1UH 18A 5.78 MOHM SMD; Tolerance: ±20%; Frequency - Test: 100kHz; DC Resistance (DCR): 5.78 mOhm Max; Inductance: 1µH; Frequency - Self Resonant: 42MHz; Shielding: Shielded; Current - Saturation: 24A; Current Rating: 18A; Type: Molded; value: 1uH; Supplier 1: Digi-Key; Supplier Part Number 1: 541-1371-6-ND; Supplier Device Package: -; Packaging: Digi-Reel®; Height - Seated (Max): 0.158" (4.00mm); RoHS: RoHS Compliant; Size / Dimension: 0.340" L x 0.322" W (8.64mm x 8.18mm); Category: Inductors, Coils, Chokes; Mounting Type: Surface Mount; Material - Core: -; Package / Case: Nonstandard; Q @ Freq: -; Operating Temperature: -55°C ~ 125°C
LED1 LED4 LED5 LED8 = LED_green_red_SMD: Manufacturer Part Number 1: HSMF-C165; Manufacturer: Avago Technologies US Inc.; Part Description: LED GREEN/RED DIFFUSED 0603 SMD; Millicandela Rating: 15mcd Green, 10mcd Red; Lens Transparency: Diffused; Lens Color: White; Lens Style/Size: Rectangle with Flat Top, 1.60mm x 0.80mm; Wavelength - Peak: 570nm Green, 636nm Red; Wavelength - Dominant: 572nm Green, 621nm Red; Viewing Angle: 120°; Voltage - Forward (Vf) (Typ): 2.2V Green, 1.95V Red; Current - Test: 20mA; Color: Green, Red; Supplier 1: Digi-Key; Height (Max): 0.50mm; Packaging: Cut Tape (CT); Category: Optoelectronics; Mounting Type: Surface Mount; Package / Case: 0603 (1608 Metric); Size / Dimension: 1.60mm L x 0.80mm W; Supplier Device Package: *; RoHS: RoHS Compliant; Supplier Part Number 1: 516-1419-1-ND
LED2 LED3 LED6 LED7 = LED_green_red: Manufacturer Part Number 1: 4301F1/5; Manufacturer: Visual Communications Company - VCC; Part Description: LED GRN/RED DIFF 3MM ROUND T/H; Voltage - Forward (Vf) (Typ): 2.1V Green, 1.8V Red; Lens Color: White; Lens Style/Size: Round with Domed Top, 3mm (T-1), 2.90mm; Millicandela Rating: 12.6mcd Green, 3.7mcd Red; Color: Green, Red; Viewing Angle: 100°; Lens Transparency: Diffused; Current - Test: 20mA Green, 20mA Red; Wavelength - Peak: 565nm Green, 660nm Red; Supplier 1: Digi-Key; Supplier Part Number 1: 4301F1/5-ND; RoHS: RoHS Compliant; Packaging: Bulk; Package / Case: Radial; Mounting Type: Through Hole; Wavelength - Dominant: -; Supplier Device Package: T-1; Size / Dimension: -; Category: Optoelectronics; Height (Max): 5.44mm
LEDS1 LEDS2 = LEDx2_STANDOFF: Manufacturer Part Number 1: H-201C; Manufacturer: Bivar Inc.; Part Description: LED HOLDER RA 3MM 2LD NYL BK; LED: T1; Supplier 1: Digi-Key; Supplier Part Number 1: 492-1790-ND; Category: Optoelectronics; RoHS: RoHS Compliant; Color: Black; Length: 0.380" (9.65mm); Material: Nylon
MECH1-MECH4 = STANDOFF_M-F_THREADED_M3x8x10mm_HEX_5mm dia: STANDOFF M/F MET 5MM HEX 10MM L; Manufacturer: FIX&FASTEN; Manufacturer Part Number: FIX-MAE-5TV; Part Description: PCB distance; polyamide; L:5mm; Colour: natural; Øcutout:3mm; Unit: pcs; SuppliedAmount: 1000; MinAmount: 10; Type of spacer: PCB distance; Panel cutout diameter: 3mm; Spanner size: 5.5mm; Internal thread: M3; Thread pitch: 0,5; Supplier 1: TME; Supplier Part Number 1: FIX-MAE-5TV; Category: Plastic Pegs; Weight: 0.145; Multiples: 10; Material: polyamide; Spacer length: 5mm; Price Type: NET
R122-R125 R128 R132 R141 R145 R146 R155 R157 R160 R165 = Res_0402: Manufacturer Part Number 1: RC0402JR-070RL; Manufacturer: Yageo; Part Description: RES SMD 0.0OHM JUMPER 1/16W 0402; Resistance (Ohms): 0.0; Tolerance: Jumper; Power (Watts): 0.063W, 1/16W; Value: 0R; Supplier 1: Digi-Key; Supplier Part Number 1: 311-0.0JRTR-ND; Category: Resistors; Temperature Coefficient: -; Features: Moisture Resistant; Supplier Device Package: 0402; Height: 0.016" (0.40mm); Package / Case: 0402 (1005 Metric); Operating Temperature: -55°C ~ 155°C; Size / Dimension: 0.039" L x 0.020" W (1.00mm x 0.50mm); Composition: Thick Film; Packaging: Tape & Reel (TR); Number of Terminations: 2; RoHS: RoHS Compliant
R126 R127 R144 = Res_0402: Manufacturer Part Number 1: RMCF0402FT100R; Manufacturer: Stackpole Electronics Inc; Part Description: RES SMD 100 OHM 1% 1/16W 0402; Power (Watts): 0.063W, 1/16W; Temperature Coefficient: ±100ppm/°C; Resistance (Ohms): 100; Value: 100R, 1%; Supplier 1: Digi-Key; Supplier Part Number 1: RMCF0402FT100RDKR-ND; Packaging: Digi-Reel®; Composition: Thick Film; Number of Terminations: 2; Package / Case: 0402 (1005 Metric); RoHS: RoHS Compliant; Category: Resistors; Size / Dimension: 0.039" L x 0.020" W (1.00mm x 0.50mm); Tolerance: ±1%; Supplier Device Package: 0402; Features: -; Height: 0.016" (0.40mm); Operating Temperature: -55°C ~ 155°C
R129 = Res_0402: Manufacturer: Yageo; Manufacturer Part Number 1: RC0402FR-071K5L; Part Description: RES SMD 1.5K OHM 1% 1/16W 0402; Resistance (Ohms): 1.5k; Power (Watts): 0.063W, 1/16W; Temperature Coefficient: ±100ppm/°C; Value: 1k5, 1%; Supplier 1: Digi-Key; Supplier Part Number 1: 311-1.50KLRTR-ND; Category: Resistors; RoHS: RoHS Compliant; Packaging: Tape & Reel (TR); Tolerance: ±1%; Composition: Thick Film; Features: Moisture Resistant; Operating Temperature: -55°C ~ 155°C; Package / Case: 0402 (1005 Metric); Supplier Device Package: 0402; Size / Dimension: 0.039" L x 0.020" W (1.00mm x 0.50mm); Height: 0.016" (0.40mm); Number of Terminations: 2
R130 R135 R151 R152 R159 = Res_0402: Manufacturer: Stackpole Electronics Inc; Manufacturer Part Number 1: RMCF0402FT1K00; Part Description: RES SMD 1K OHM 1% 1/16W 0402; Temperature Coefficient: ±100ppm/°C; Power (Watts): 0.063W, 1/16W; Value: 1k, 1%; Supplier 1: Digi-Key; Supplier Part Number 1: RMCF0402FT1K00TR-ND; Resistance (Ohms): 1k; Packaging: Tape & Reel (TR); Category: Resistors; RoHS: RoHS Compliant; Tolerance: ±1%; Height: 0.016" (0.40mm); Number of Terminations: 2; Package / Case: 0402 (1005 Metric); Operating Temperature: -55°C ~ 155°C; Features: -; Composition: Thick Film; Supplier Device Package: 0402; Size / Dimension: 0.039" L x 0.020" W (1.00mm x 0.50mm)
R131 R133 R148 = Res_0402: Manufacturer Part Number 1: RMCF0402FT249R; Manufacturer: Stackpole Electronics Inc; Part Description: RES SMD 249 OHM 1% 1/16W 0402; Resistance (Ohms): 249; Power (Watts): 0.063W, 1/16W; Temperature Coefficient: ±100ppm/°C; Value: 249R, 1%; Supplier 1: Digi-Key; Supplier Part Number 1: RMCF0402FT249RCT-ND; Package / Case: 0402 (1005 Metric); Features: -; Size / Dimension: 0.039" L x 0.020" W (1.00mm x 0.50mm); Category: Resistors; Operating Temperature: -55°C ~ 155°C; Packaging: Cut Tape (CT); Tolerance: ±1%; Supplier Device Package: 0402; RoHS: RoHS Compliant; Composition: Thick Film; Number of Terminations: 2; Height: 0.016" (0.40mm)
R134 R147 R156 = Res_0402: Manufacturer Part Number 1: RMCF0402FT806R; Manufacturer: Stackpole Electronics Inc; Part Description: RES SMD 806 OHM 1% 1/16W 0402; Resistance (Ohms): 806; Power (Watts): 0.063W, 1/16W; Temperature Coefficient: ±100ppm/°C; Value: 806R, 1%; Supplier 1: Digi-Key; Supplier Part Number 1: RMCF0402FT806RCT-ND; Category: Resistors; Size / Dimension: 0.039" L x 0.020" W (1.00mm x 0.50mm); Tolerance: ±1%; Features: -; Number of Terminations: 2; RoHS: RoHS Compliant; Operating Temperature: -55°C ~ 155°C; Packaging: Cut Tape (CT); Package / Case: 0402 (1005 Metric); Composition: Thick Film; Height: 0.016" (0.40mm); Supplier Device Package: 0402
R136 R140 R142 R149 R153 R158 R161 R163 = Res_0402: Manufacturer: Yageo; Manufacturer Part Number 1: RC0402FR-0710KL; Part Description: RES SMD 10K OHM 1% 1/16W 0402; Temperature Coefficient: ±100ppm/°C; Power (Watts): 0.063W, 1/16W; Value: 10k, 1%; Supplier 1: Digi-Key; Supplier Part Number 1: 311-10.0KLRTR-ND; Resistance (Ohms): 10k; Packaging: Tape & Reel (TR); RoHS: RoHS Compliant; Package / Case: 0402 (1005 Metric); Tolerance: ±1%; Operating Temperature: -55°C ~ 155°C; Size / Dimension: 0.039" L x 0.020" W (1.00mm x 0.50mm); Number of Terminations: 2; Category: Resistors; Height: 0.016" (0.40mm); Supplier Device Package: 0402; Features: Moisture Resistant; Composition: Thick Film
R137 = Res_0402: Manufacturer: Panasonic Electronic Components; Manufacturer Part Number: ERJ-2GEJ104X; Part Description: RES SMD 100K OHM 5% 1/10W 0402; Power (Watts): 0.1W, 1/10W; Temperature Coefficient: ±200ppm/°C; Value: 100k, 5%; Supplier 1: Digi-Key; Supplier Part Number 1: P100KJTR-ND; Category: Resistors; Size / Dimension: 0.039" L x 0.020" W (1.00mm x 0.50mm); Supplier Device Package: 0402; Composition: Thick Film; Number of Terminations: 2; RoHS: RoHS Compliant; Height: 0.016" (0.40mm); Operating Temperature: -55°C ~ 155°C; Features: Automotive AEC-Q200; Tolerance: ±5%; Packaging: Tape & Reel (TR); Resistance (Ohms): 100k; Package / Case: 0402 (1005 Metric)
R138 = Res_0402: Manufacturer: Stackpole Electronics Inc.; Manufacturer Part Number 1: RMCF0402FT2K21; Part Description: RES SMD 2.21K OHM 1% 1/16W 0402; Power (Watts): 0.063W, 1/16W; Temperature Coefficient: ±100ppm/°C; Value: 2.21k, 1%; Supplier 1: Digi-Key; Supplier Part Number 1: RMCF0402FT2K21CT-ND; Operating Temperature: -55°C ~ 155°C; Height: 0.016" (0.40mm); Tolerance: ±1%; Resistance (Ohms): 2.21k; Features: Automotive AEC-Q200; Package / Case: 0402 (1005 Metric); Packaging: Cut Tape (CT); Composition: Thick Film; Category: Resistors; Supplier Device Package: 0402; Number of Terminations: 2; RoHS: RoHS Compliant; Size / Dimension: 0.039" L x 0.020" W (1.00mm x 0.50mm)
R139 = Res_0402: Manufacturer Part Number 1: ERJ-2RKF4422X; Manufacturer: Panasonic Electronic Components; Part Description: RES SMD 44.2K OHM 1% 1/10W 0402; Power (Watts): 0.1W, 1/10W; Temperature Coefficient: ±100ppm/°C; Value: 44.2k, 1%; Supplier 1: Digi-Key; Supplier Part Number 1: P44.2KLCT-ND; Tolerance: ±1%; Supplier Device Package: 0402; Packaging: Cut Tape (CT); Size / Dimension: 0.039" L x 0.020" W (1.00mm x 0.50mm); Features: Automotive AEC-Q200; Package / Case: 0402 (1005 Metric); Height: 0.016" (0.40mm); Operating Temperature: -55°C ~ 155°C; Number of Terminations: 2; Composition: Thick Film; Resistance (Ohms): 44.2k; RoHS: RoHS Compliant; Category: Resistors
R143 = Res_0402: Manufacturer: Stackpole Electronics Inc; Manufacturer Part Number 1: RMCF0402FT40R2; Part Description: RES SMD 40.2 OHM 1% 1/16W 0402; Power (Watts): 0.063W, 1/16W; Resistance (Ohms): 40.2; Temperature Coefficient: ±100ppm/°C; Value: 40R2, 1%; Supplier 1: Digi-Key; Supplier Part Number 1: RMCF0402FT40R2CT-ND; Category: Resistors; Features: -; Packaging: Cut Tape (CT); Supplier Device Package: 0402; Operating Temperature: -55°C ~ 155°C; Tolerance: ±1%; RoHS: RoHS Compliant; Composition: Thick Film; Size / Dimension: 0.039" L x 0.020" W (1.00mm x 0.50mm); Package / Case: 0402 (1005 Metric); Height: 0.016" (0.40mm); Number of Terminations: 2
R150 = Res_0402: Manufacturer: Panasonic Electronic Components; Manufacturer Part Number 1: ERJ-2RKF1243X; Part Description: RES SMD 124K OHM 1% 1/10W 0402; Power (Watts): 0.1W, 1/10W; Temperature Coefficient: ±100ppm/°C; Value: 124k, 1%; Supplier 1: Digi-Key; Supplier Part Number 1: P124KLCT-ND; Category: Resistors; Package / Case: 0402 (1005 Metric); Operating Temperature: -55°C ~ 155°C; Tolerance: ±1%; Packaging: Cut Tape (CT); Resistance (Ohms): 124k; Features: Automotive AEC-Q200; Height: 0.016" (0.40mm); Number of Terminations: 2; Supplier Device Package: 0402; Size / Dimension: 0.039" L x 0.020" W (1.00mm x 0.50mm); RoHS: RoHS Compliant; Composition: Thick Film
R154 = Res_0402: Manufacturer Part Number 1: ERJ-2RKF6652X; Manufacturer: Panasonic Electronic Components; Part Description: RES SMD 66.5K OHM 1% 1/10W 0402; Temperature Coefficient: ±100ppm/°C; Power (Watts): 0.1W, 1/10W; Value: 66.5k, 1%; Supplier 1: Digi-Key; Supplier Part Number 1: P66.5KLDKR-ND; Packaging: Digi-Reel®; Operating Temperature: -55°C ~ 155°C; Height: 0.016" (0.40mm); Size / Dimension: 0.039" L x 0.020" W (1.00mm x 0.50mm); Number of Terminations: 2; Package / Case: 0402 (1005 Metric); Resistance (Ohms): 66.5k; Category: Resistors; Supplier Device Package: 0402; Features: Automotive AEC-Q200; Composition: Thick Film; RoHS: RoHS Compliant; Tolerance: ±1%
R162 = Res_0402: Manufacturer: Vishay Dale; Manufacturer Part Number: CRCW040230K0FKED; Part Description: RES SMD 30K OHM 1% 1/16W 0402; Temperature Coefficient: ±100ppm/°C; Power (Watts): 0.063W, 1/16W; Value: 30k, 1%; Size / Dimension: 0.039" L x 0.020" W (1.00mm x 0.50mm); Number of Terminations: 2; Height: 0.016" (0.40mm); Supplier Device Package: 0402 (1005 Metric); Composition: Thick Film; Features: Automotive AEC-Q200; Supplier Part Number 1: 541-30.0KLCT-ND; RoHS: RoHS Compliant; Packaging: Cut Tape (CT); Resistance (Ohms): 30k; Operating Temperature: -55°C ~ 155°C; Supplier 1: Digi-Key; Tolerance: ±1%; Category: Resistors; Package / Case: 0402 (1005 Metric)
R164 = Res_0402: Manufacturer Part Number: CRCW040218K0FKED; Manufacturer: Vishay Dale; Part Description: RES SMD 18K OHM 1% 1/16W 0402; Temperature Coefficient: ±100ppm/°C; Power (Watts): 0.063W, 1/16W; Value: 18k, 1%; Operating Temperature: -55°C ~ 155°C; Composition: Thick Film; RoHS: RoHS Compliant; Features: Automotive AEC-Q200; Package / Case: 0402 (1005 Metric); Resistance (Ohms): 18k; Number of Terminations: 2; Supplier Device Package: 0402 (1005 Metric); Tolerance: ±1%; Packaging: Cut Tape (CT); Height: 0.016" (0.40mm); Size / Dimension: 0.039" L x 0.020" W (1.00mm x 0.50mm); Supplier 1: Digi-Key; Supplier Part Number 1: 541-18.0KLCT-ND; Category: Resistors
VD1 = DIODE_SCHOTTKY_SOD-523F: Diode Schottky SMD SOD-523F; Manufacturer Part Number 1: SK36A-LTP; Manufacturer: Micro Commercial Co; Part Description: DIODE SCHOTTKY 60V 3A DO214AC; Current - Reverse Leakage @ Vr: 500µA @ 60V; Speed: Fast Recovery =< 500ns, > 200mA (Io); Voltage - DC Reverse (Vr) (Max): 60V; Capacitance @ Vr, F: 250pF @ 4V, 1MHz; Voltage - Forward (Vf) (Max) @ If: 750mV @ 3A; Current - Average Rectified (Io): 3A; Supplier 1: Digi-Key; Supplier Part Number 1: SK36A-LTPMSCT-ND; Package / Case: DO-214AC, SMA; Reverse Recovery Time (trr): -; Diode Type: Schottky; Category: Discrete Semiconductor Products; Mounting Type: Surface Mount; RoHS: RoHS Compliant; Packaging: Cut Tape (CT); Operating Temperature - Junction: -50°C ~ 125°C; Supplier Device Package: DO-214AC (SMA)